# EAGLE schematic schemat (EAGLE 9.3.2)
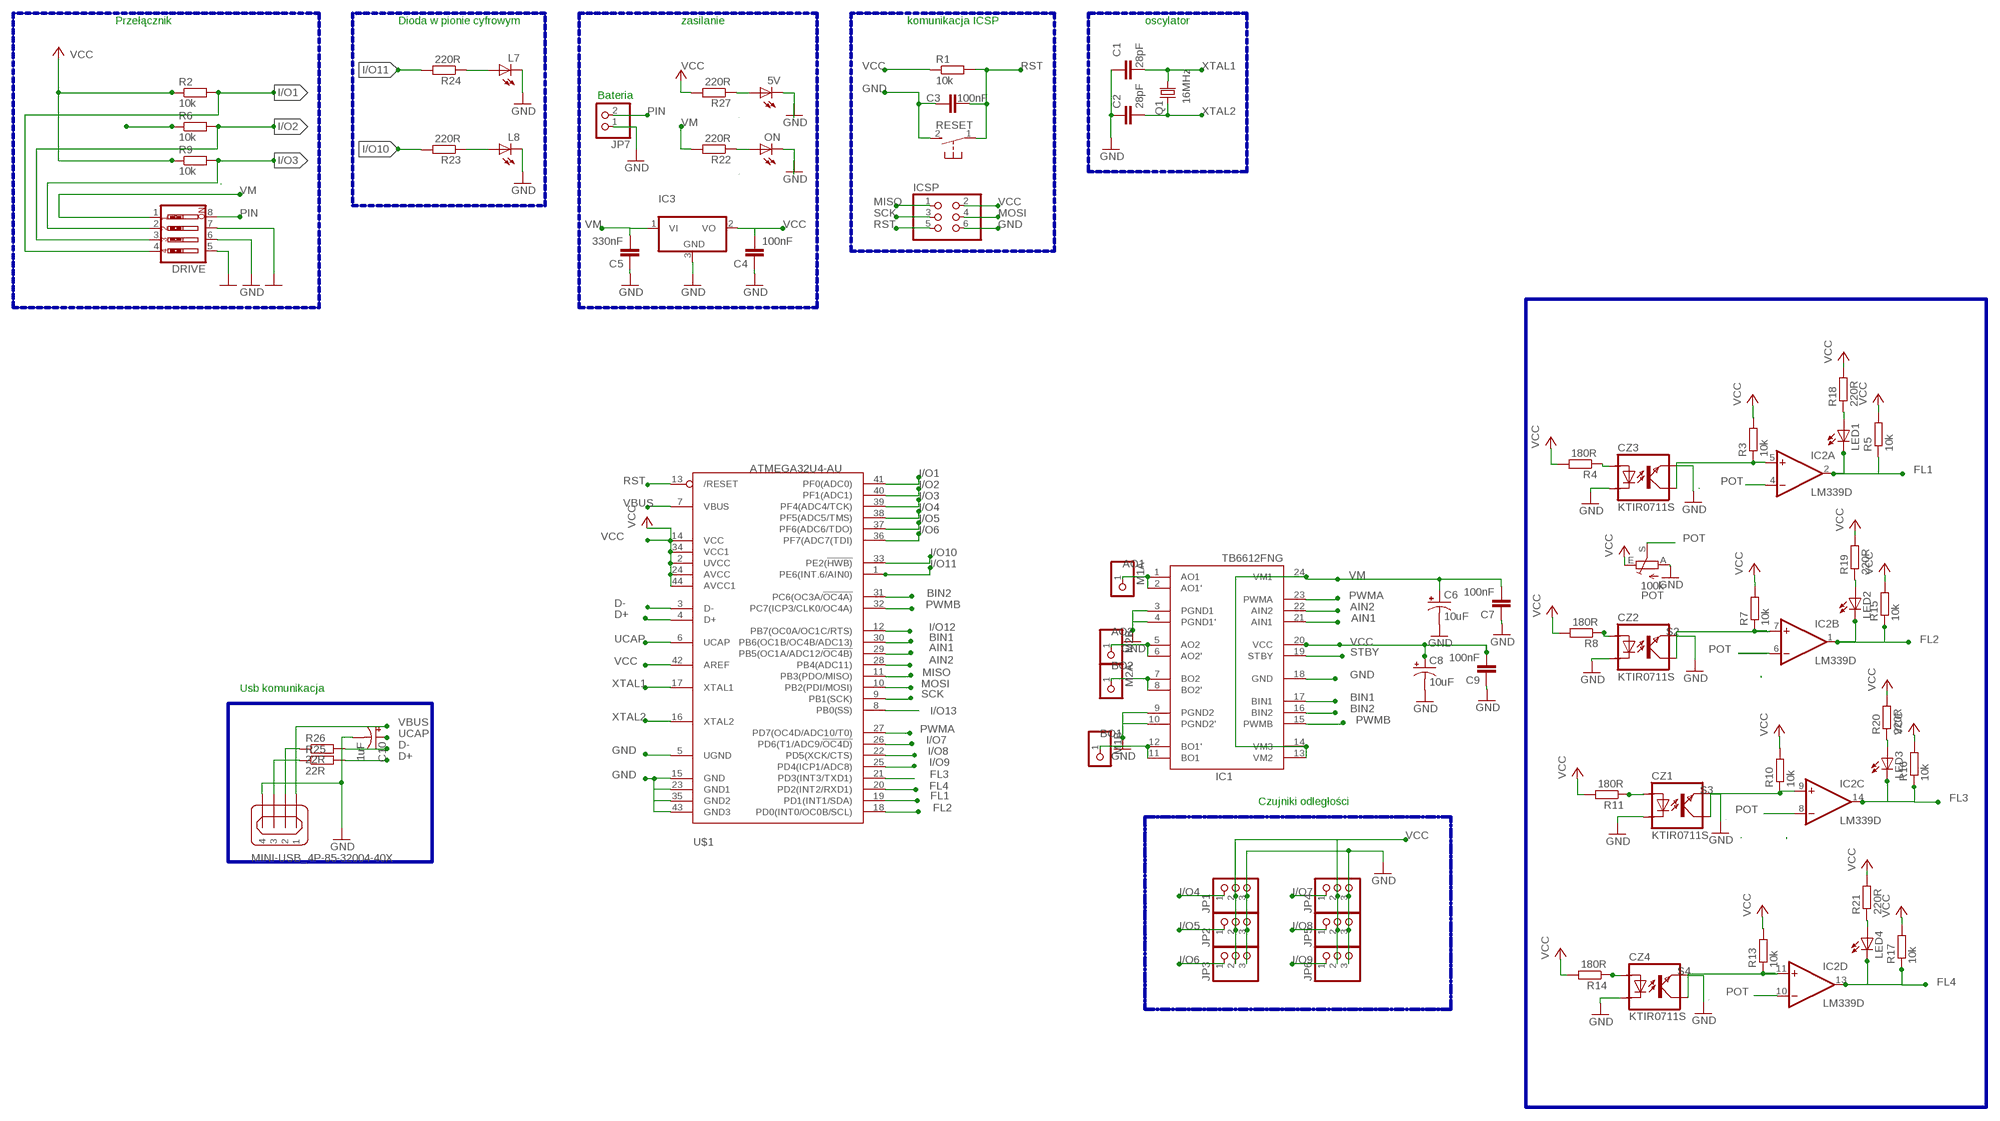
[diagram p0: schematic, sheet 1]

## Parts
5V  LEDCHIP-LED0805  [CHIP-LED0805]
C1  28pF  C-EUC0805  [C0805]
C2  28pF  C-EUC0805  [C0805]
C3  100nF  C-EUC0805  [C0805]
C4  100nF  C-EUC0805  [C0805]
C5  330nF  C-EUC0805  [C0805]
C6  10uF  CPOL-USUD-4X5,8  [UD-4X5,8_NICHICON]
C7  100nF  C-EUC0805  [C0805]
C8  10uF  CPOL-USUD-4X5,8  [UD-4X5,8_NICHICON]
C9  100nF  C-EUC0805  [C0805]
C10  1uF  CPOL-USUD-4X5,8  [UD-4X5,8_NICHICON]
CZ1  KTIR0711S  [TOP]
CZ2  KTIR0711S  [TOP]
CZ3  KTIR0711S  [TOP]
CZ4  KTIR0711S  [TOP]
DRIVE  SW_DIP-4  [EDG-04]
IC1  TB6612FNG  [SSOP24]
IC2  LM339D  [SO14]
IC3  7806DT  [TO252]
ICSP  PINHD-2X3  [2X03]
JP1  PINHD-1X3  [1X03]
JP2  PINHD-1X3  [1X03]
JP3  PINHD-1X3  [1X03]
JP4  PINHD-1X3  [1X03]
JP5  PINHD-1X3  [1X03]
JP6  PINHD-1X3  [1X03]
JP7  PINHD-1X2  [1X02]
L7  LEDCHIP-LED0805  [CHIP-LED0805]
L8  LEDCHIP-LED0805  [CHIP-LED0805]
LED1  LEDCHIP-LED0805  [CHIP-LED0805]
LED2  LEDCHIP-LED0805  [CHIP-LED0805]
LED3  LEDCHIP-LED0805  [CHIP-LED0805]
LED4  LEDCHIP-LED0805  [CHIP-LED0805]
M1A  PINHD-1X1  [1X01]
M1B  PINHD-1X1  [1X01]
M2A  PINHD-1X1  [1X01]
M2B  PINHD-1X1  [1X01]
ON  LEDCHIP-LED0805  [CHIP-LED0805]
POT  100k  TRIM_EU-CA6V  [CA6V]
Q1  16MHz  CSM-7X-DU  [CSM-7X-DU]
R1  10k  R-EU_R0805  [R0805]
R2  10k  R-EU_R0805  [R0805]
R3  10k  R-EU_R0805  [R0805]
R4  180R  R-EU_R0805  [R0805]
R5  10k  R-EU_R0805  [R0805]
R6  10k  R-EU_R0805  [R0805]
R7  10k  R-EU_R0805  [R0805]
R8  180R  R-EU_R0805  [R0805]
R9  10k  R-EU_R0805  [R0805]
R10  10k  R-EU_R0805  [R0805]
R11  180R  R-EU_R0805  [R0805]
R13  10k  R-EU_R0805  [R0805]
R14  180R  R-EU_R0805  [R0805]
R15  10k  R-EU_R0805  [R0805]
R16  10k  R-EU_R0805  [R0805]
R17  10k  R-EU_R0805  [R0805]
R18  220R  R-EU_R0805  [R0805]
R19  220R  R-EU_R0805  [R0805]
R20  220R  R-EU_R0805  [R0805]
R21  220R  R-EU_R0805  [R0805]
R22  220R  R-EU_R0805  [R0805]
R23  220R  R-EU_R0805  [R0805]
R24  220R  R-EU_R0805  [R0805]
R25  22R  R-EU_R0805  [R0805]
R26  22R  R-EU_R0805  [R0805]
R27  220R  R-EU_R0805  [R0805]
RESET  DTS-3  [DTS-3]
U$1  ATMEGA32U4-AU  [TQFP44]
USB  MINI-USB_4P-85-32004-40X  [85-32004-40X]

## Nets
AIN1: IC1.21(AIN1) U$1.29(PB5(OC1A/ADC12/!OC4B))
AIN2: IC1.22(AIN2) U$1.28(PB4(ADC11))
AO1: IC1.1(AO1) IC1.2(AO1') M1A.1
AO2: IC1.5(AO2) IC1.6(AO2') M2B.1
BIN1: IC1.17(BIN1) U$1.30(PB6(OC1B/OC4B/ADC13))
BIN2: IC1.16(BIN2) U$1.31(PC6(OC3A/!OC4A))
BO1: IC1.11(BO1) IC1.12(BO1') M1B.1
BO2: IC1.7(BO2) IC1.8(BO2') M2A.1
D+: R25.2 U$1.4(D+)
D-: R26.2 U$1.3(D-)
FL1: IC2.2(A:OUT) LED1.C R5.1 U$1.19(PD1(INT1/SDA))
FL2: IC2.1(B:OUT) LED2.C R15.1 U$1.18(PD0(INT0/OC0B/SCL))
FL3: IC2.14(C:OUT) LED3.C R16.1 U$1.21(PD3(INT3/TXD1))
FL4: IC2.13(D:OUT) LED4.C R17.1 U$1.20(PD2(INT2/RXD1))
GND: 5V.C C1.1 C2.1 C3.1 C4.1 C5.1 C6.- C7.1 C8.- C9.1 C10.- CZ1.EMITER CZ1.KATODA CZ2.EMITER CZ2.KATODA CZ3.EMITER CZ3.KATODA CZ4.EMITER CZ4.KATODA DRIVE.5 DRIVE.6 DRIVE.7 IC1.3(PGND1) IC1.4(PGND1') IC1.9(PGND2) IC1.10(PGND2') IC1.18(GND) IC3.3(GND) ICSP.6 JP1.3 JP2.3 JP3.3 JP4.3 JP5.3 JP6.3 JP7.1 L7.C L8.C ON.C POT.A RESET.2 U$1.5(UGND) U$1.15(GND) U$1.23(GND1) U$1.35(GND2) U$1.43(GND3) USB.4
I/O1: DRIVE.4 R2.2 U$1.41(PF0(ADC0))
I/O2: DRIVE.3 R6.2 U$1.40(PF1(ADC1))
I/O3: DRIVE.2 R9.2 U$1.39(PF4(ADC4/TCK))
I/O4: JP1.1 U$1.38(PF5(ADC5/TMS))
I/O5: JP2.1 U$1.37(PF6(ADC6/TDO))
I/O6: JP3.1 U$1.36(PF7(ADC7(TDI))
I/O7: JP4.1 U$1.26(PD6(T1/ADC9/!OC4D))
I/O8: JP5.1 U$1.22(PD5(XCK/CTS))
I/O9: JP6.1 U$1.25(PD4(ICP1/ADC8))
I/O10: R23.2 U$1.33(PE2(!HWB))
I/O11: R24.2 U$1.1(PE6(INT.6/AIN0))
I/O12: U$1.12(PB7(OC0A/OC1C/RTS))
I/O13: U$1.8(PB0(SS))
MISO: ICSP.1 U$1.11(PB3(PDO/MISO))
MOSI: ICSP.4 U$1.10(PB2(PDI/MOSI))
N$1: CZ3.KOLEKTOR IC2.5(A:+IN) R3.1
N$2: L8.A R23.1
N$7: 5V.A R27.1
N$11: R26.1 USB.2
N$12: R25.1 USB.3
N$13: LED1.A R18.1
N$14: CZ3.ANODA R4.1
N$15: LED2.A R19.1
N$16: LED3.A R20.1
N$17: LED4.A R21.1
N$18: L7.A R24.1
N$19: CZ2.ANODA R8.1
N$23: CZ1.ANODA R11.1
N$27: CZ4.ANODA R14.1
N$33: ON.A R22.1
N$34: R22.2
PIN: DRIVE.8 JP7.2
POT: IC2.4(A:-IN) IC2.6(B:-IN) IC2.8(C:-IN) IC2.10(D:-IN) POT.S
PWMA: IC1.23(PWMA) U$1.27(PD7(OC4D/ADC10/T0))
PWMB: IC1.15(PWMB) U$1.32(PC7(ICP3/CLK0/OC4A))
RST: C3.2 ICSP.5 R1.2 RESET.1 U$1.13(/RESET)
S2: CZ2.KOLEKTOR IC2.7(B:+IN) R7.1
S3: CZ1.KOLEKTOR IC2.9(C:+IN) R10.1
S4: CZ4.KOLEKTOR IC2.11(D:+IN) R13.1
SCK: ICSP.3 U$1.9(PB1(SCK))
STBY: IC1.19(STBY)
UCAP: C10.+ U$1.6(UCAP)
VBUS: U$1.7(VBUS) USB.1
VCC: C4.2 C8.+ C9.2 IC1.20(VCC) IC3.2(VO) ICSP.2 JP1.2 JP2.2 JP3.2 JP4.2 JP5.2 JP6.2 POT.E R1.1 R2.1 R3.2 R4.2 R5.2 R6.1 R7.2 R8.2 R9.1 R10.2 R11.2 R13.2 R14.2 R15.2 R16.2 R17.2 R18.2 R19.2 R20.2 R21.2 R27.2 U$1.2(UVCC) U$1.14(VCC) U$1.24(AVCC) U$1.34(VCC1) U$1.42(AREF) U$1.44(AVCC1)
VM: C5.2 C6.+ C7.2 DRIVE.1 IC1.13(VM2) IC1.14(VM3) IC1.24(VM1) IC3.1(VI)
XTAL1: C1.2 Q1.2 U$1.17(XTAL1)
XTAL2: C2.2 Q1.1 U$1.16(XTAL2)

## Buses
B$2
B$4
B$3
B$6
B$7
B$8
B$5
XTAL1,XTAL2,GND

## Notes on the sheet
- Przełącznik | Dioda w pionie cyfrowym | zasilanie | komunikacja ICSP | oscylator
- Bateria
- Usb komunikacja
- Czujniki odległości

## Power pins joined to a net without a drawn wire
GND: IC2.12(P:GND)
V+: IC2.3(P:V+)

## Library data of the parts
5V L7 L8 LED1-LED4 ON = led:LED: LED OSRAM: - CHIPLED LG R971, LG N971, LY N971, LG Q971, LY Q971, LO R971, LY R971 LH N974, LH R974 LS Q976, LO Q976, LY Q976 LO Q996 - Hyper CHIPLED LW Q18S LB Q993, LB Q99A, LB R99A - SideLED LS A670, LO A670, LY A670, LG A670, LP A670 LB A673, LV A673, LT A673, LW A673 LH A674 LY A675 LS A676, LA A676, LO A676, LY A676, LW A676 LS A679, LY A679, LG A679 - Hyper Micro SIDELED® LS Y876, LA Y876, LO Y876, LY Y876 LT Y87S - SmartLED LW L88C, LW L88S LB L89C, LB L89S, LG L890 LS L89K, LO L89K, LY L89K LS L896, LA L896, LO L896, LY L896 - TOPLED LS T670, LO T670, LY T670, LG T670, LP T670 LSG T670, LSP T670, LSY T670, LOP T670, LYG T670 LG T671, LOG T671, LSG T671 LB T673, LV T673, LT T673, LW T673 LH T674 LS T676, LA T676, LO T676, LY T676, LB T676, LH T676, LSB T676, LW T676 LB T67C, LV T67C, LT T67C, LS T67K, LO T67K, LY T67K, LW E67C LS E67B, LA E67B, LO E67B, LY E67B, LB E67C, LV E67C, LT E67C LW T67C LS T679, LY T679, LG T679 LS T770, LO T770, LY T770, LG T770, LP T770 LB T773, LV T773, LT T773, LW T773 LH T774 LS E675, LA E675, LY E675, LS T675 LS T776, LA T776, LO T776, LY T776, LB T776 LHGB T686 LT T68C, LB T68C - Hyper Mini TOPLED® LB M676 - Mini TOPLED Santana® LG M470 LS M47K, LO M47K, LY M47K Source: http://www.osram.convergy.de LUXEON: - LUMILED® LXK2-PW12-R00, LXK2-PW12-S00, LXK2-PW14-U00, LXK2-PW14-V00 LXK2-PM12-R00, LXK2-PM12-S00, LXK2-PM14-U00 LXK2-PE12-Q00, LXK2-PE12-R00, LXK2-PE12-S00, LXK2-PE14-T00, LXK2-PE14-U00 LXK2-PB12-K00, LXK2-PB12-L00, LXK2-PB12-M00, LXK2-PB14-N00, LXK2-PB14-P00, LXK2-PB14-Q00 LXK2-PR12-L00, LXK2-PR12-M00, LXK2-PR14-Q00, LXK2-PR14-R00 LXK2-PD12-Q00, LXK2-PD12-R00, LXK2-PD12-S00 LXK2-PH12-R00, LXK2-PH12-S00 LXK2-PL12-P00, LXK2-PL12-Q00, LXK2-PL12-R00 Source: www.luxeon.com KINGBRIGHT: KA-3528ASYC Source: www.kingbright.com
C1-C5 C7 C9 = rcl:C-EU: CAPACITOR, European symbol; SPICEPREFIX: C
C6 C8 C10 = rcl:CPOL-US: POLARIZED CAPACITOR, American symbol; SPICEPREFIX: C
CZ1-CZ4 = ktir0711s:KTIR0711S
DRIVE = special:SW_DIP-4: DIP SWITCH
IC1 = adafruit:TB6612FNG: TB6612FNG MOS dual H-bridge motor driver, 1.2A current 3.2A peak 3 or 5v logic and 3-15v motor
IC2 = linear:LM339: Low Power Low Offset Voltage Quad Comparators with open collector; LM139/LM239/LM339/LM2901/LM3302
IC3 = linear3:78*: Positive VOLTAGE REGULATOR Source: http://cache.national.com/ds/LM/LM78L05.pdf http://www.fairchildsemi.com/ds/LM/LM7805.pdf
ICSP = pinhead:PINHD-2X3: PIN HEADER
JP1-JP6 = pinhead:PINHD-1X3: PIN HEADER
JP7 = pinhead:PINHD-1X2: PIN HEADER
M1A M1B M2A M2B = pinhead:PINHD-1X1: PIN HEADER
POT = pot:TRIM_EU-: POTENTIOMETER
Q1 = crystal:CSM-7X-DU: SMD CRYSTAL Source: www.ecsxtal.com .. Crystal 3.6864MHz CSM_7X_DU.PDF; OC_FARNELL: unknown; OC_NEWARK: unknown
R1-R11 R13-R27 = rcl:R-EU_: RESISTOR, European symbol; SPICEPREFIX: R
RESET = switch-tact (1):DTS-3
U$1 = adafruit:ATMEGA32U4: http://www.ladyada.net/library/eagle
USB = con-cypressindustries:MINI-USB_4P-: MINI USB 4 Pol. Source: www.cypressindustries.com; OC_FARNELL: unknown; OC_NEWARK: unknown